# EAGLE design timerV2 (EAGLE 6.5.0)
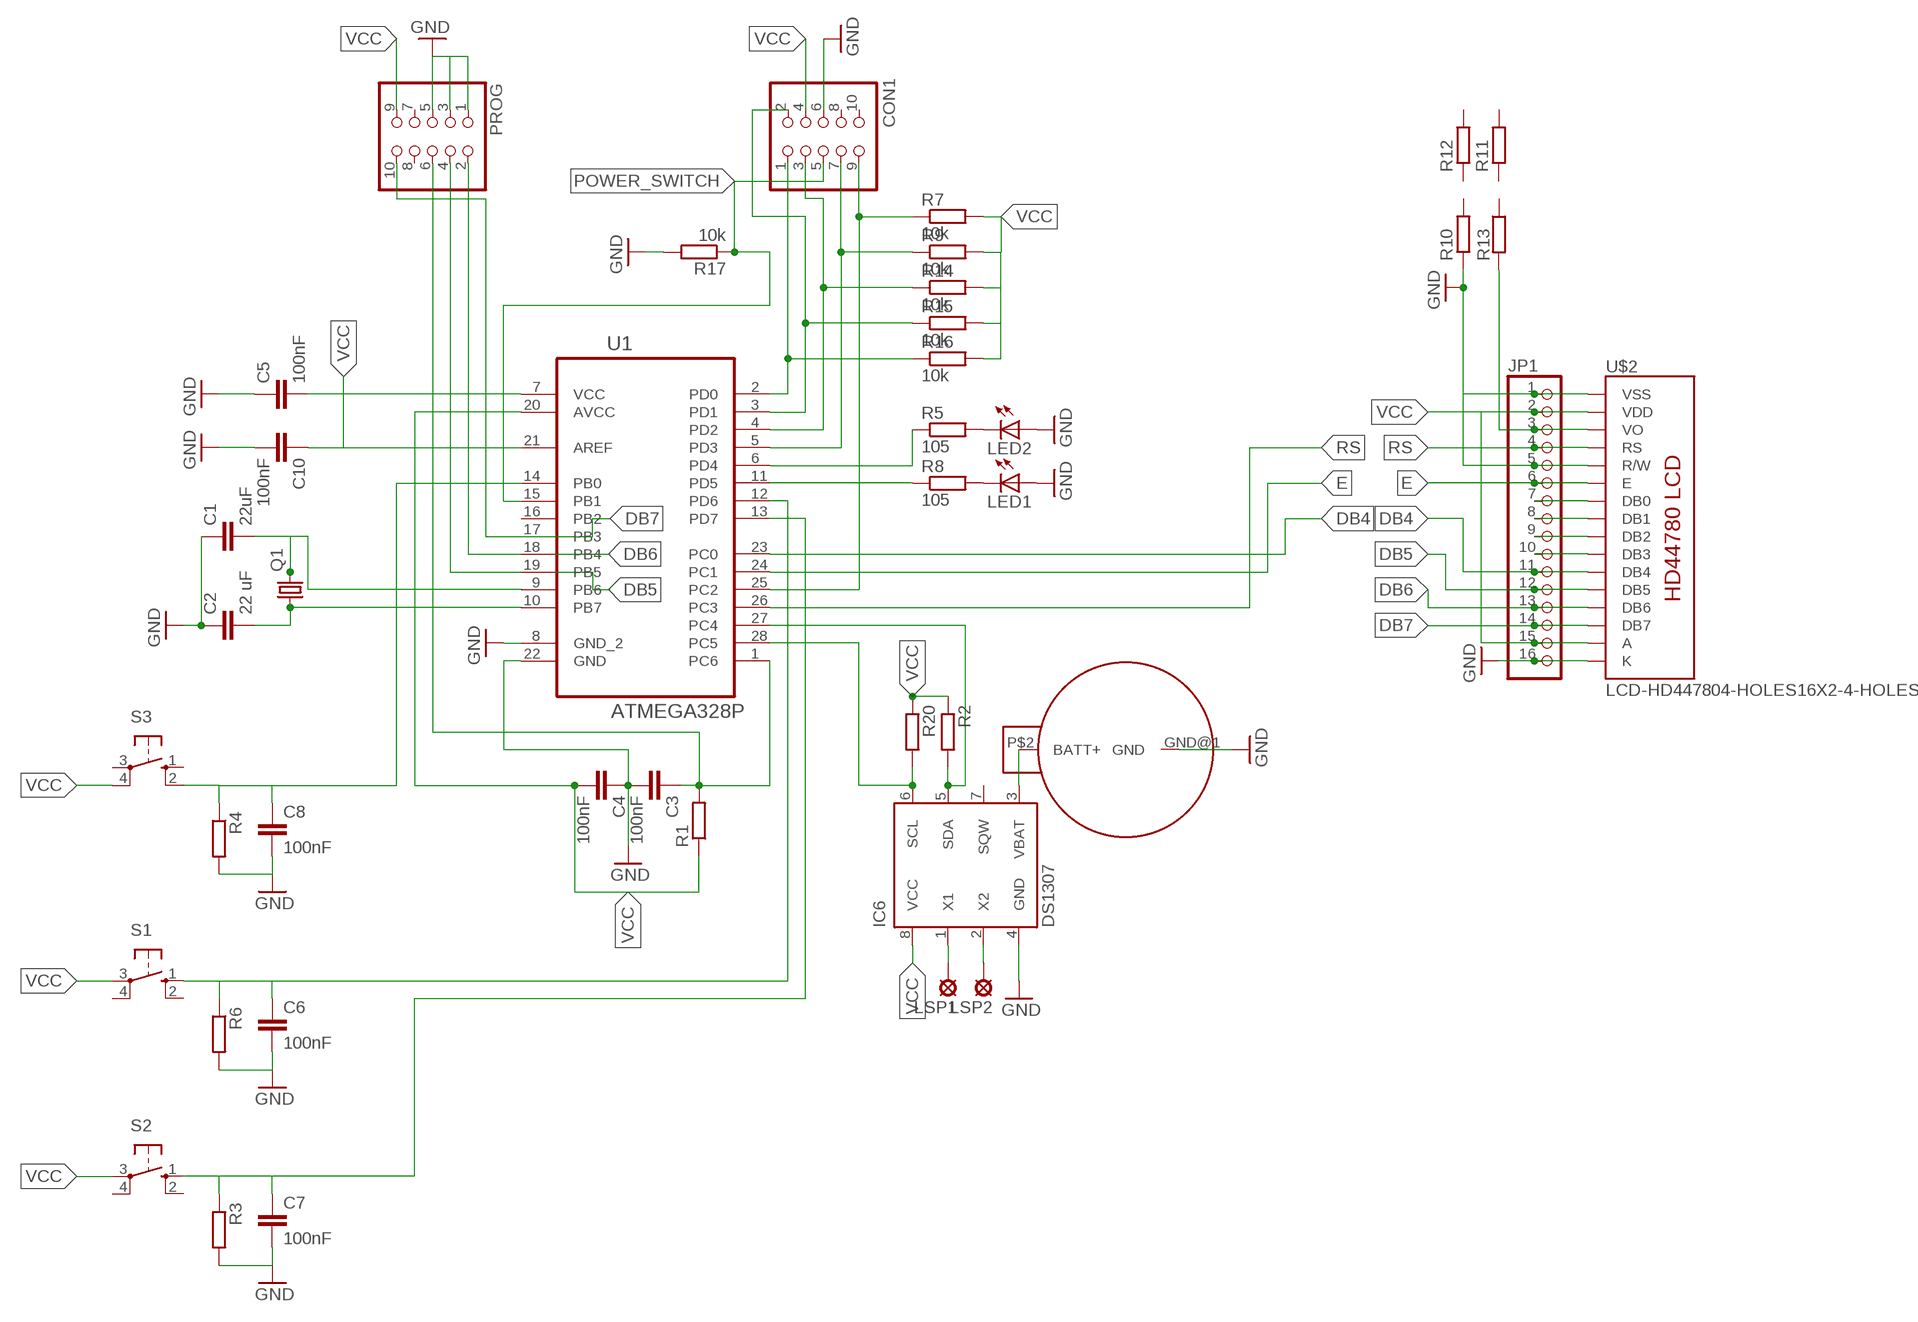
[diagram p0: schematic, sheet 1]

## Parts
C1  22uF  C-EU025-025X050  [C025-025X050]
C2  22 uF  C-EU025-025X050  [C025-025X050]
C3  100nF  CC0603  [C0603]
C4  100nF  CC0603  [C0603]
C5  100nF  CC0603  [C0603]
C6  100nF  CC0603  [C0603]
C7  100nF  CC0603  [C0603]
C8  100nF  CC0603  [C0603]
C10  100nF  CC0603  [C0603]
CON1  PINHD-2X5  [2X05]
IC6  DS1307  [DIL08]
JP1  PINHD-1X16  [1X16]
LED1  LED5MM  [LED5MM]
LED2  LED5MM  [LED5MM]
LSP1  LSP10  [LSP10]
LSP2  LSP10  [LSP10]
PROG  PINHD-2X5  [2X05]
Q1  CRYSTALHC49U-V  [HC49U-V]
R1  RR0603  [R0603]
R2  RR0603  [R0603]
R3  RR0603  [R0603]
R4  RR0603  [R0603]
R5  105  RR0603  [R0603]
R6  RR0603  [R0603]
R7  10k  RR0603  [R0603]
R8  105  RR0603  [R0603]
R9  10k  RR0603  [R0603]
R10  RR0603  [R0603]
R11  RR0603  [R0603]
R12  RR0603  [R0603]
R13  RR0603  [R0603]
R14  10k  RR0603  [R0603]
R15  10k  RR0603  [R0603]
R16  10k  RR0603  [R0603]
R17  10k  RR0603  [R0603]
R20  RR0603  [R0603]
S1  10-XX  [B3F-10XX]
S2  10-XX  [B3F-10XX]
S3  10-XX  [B3F-10XX]
U1  ATMEGA328P  ATMEGA328P-PU  [DIP254P762X457-28]
U$1  CR2032  [CR2023]
U$2  LCD-HD447804-HOLES16X2-4-HOLES  [LCD-16X2-4HOLES]

## Nets
DB4: JP1.11 U1.23(PC0) U$2.11(DB4)
DB5: JP1.12 PROG.4 U1.19(PB5) U$2.12(DB5)
DB6: JP1.13 PROG.2 U1.18(PB4) U$2.13(DB6)
DB7: JP1.14 PROG.10 U1.17(PB3) U$2.14(DB7)
E: JP1.6 U1.24(PC1) U$2.6(E)
GND: C1.1 C2.1 C3.2 C4.1 C5.1 C6.2 C7.2 C8.2 C10.2 CON1.6 IC6.4(GND) JP1.1 JP1.5 JP1.16 LED1.A LED2.A PROG.1 PROG.3 PROG.5 R3.2 R4.2 R6.2 R10.1 R17.2 U1.8(GND_2) U1.22(GND) U$1.GND@1(GND) U$2.1(VSS) U$2.5(R/W) U$2.16(K)
N$1: LED2.K(C) R5.2
N$2: JP1.3 R13.2 U$2.3(VO)
N$4: LED1.K(C) R8.2
N$5: C3.1 PROG.6 R1.2 U1.1(PC6)
N$8: C7.1 R3.1 S2.1(S) U1.13(PD7)
N$9: CON1.2 R15.1 U1.3(PD1)
N$10: JP1.7 U$2.7(DB0)
N$11: C8.1 R4.1 S3.2(S1) U1.14(PB0)
N$12: CON1.7 R9.1 U1.5(PD3)
N$13: R8.1 U1.11(PD5)
N$14: R5.1 U1.6(PD4)
N$15: CON1.1 R16.1 U1.2(PD0)
N$16: JP1.8 U$2.8(DB1)
N$17: CON1.3 R14.1 U1.4(PD2)
N$18: JP1.9 U$2.9(DB2)
N$19: JP1.10 U$2.10(DB3)
N$20: C6.1 R6.1 S1.1(S) U1.12(PD6)
N$33: IC6.2(X2) LSP2.MP
N$37: IC6.1(X1) LSP1.MP
N$38: IC6.3(VBAT) U$1.P$2(BATT+)
N$39: IC6.6(SCL) R20.2 U1.28(PC5)
N$40: IC6.5(SDA) R2.2 U1.27(PC4)
N$44: C1.2 Q1.2 U1.9(PB6)
N$46: C2.2 Q1.1 U1.10(PB7)
POWER_SWITCH: CON1.5 R17.1 U1.15(PB1)
RS: JP1.4 U1.26(PC3) U$2.4(RS)
RW: CON1.9 R7.1 U1.25(PC2)
VCC: C4.2 C5.2 C10.1 CON1.4 IC6.8(VCC) JP1.2 JP1.15 PROG.9 R1.1 R2.1 R7.2 R9.2 R14.2 R15.2 R16.2 R20.1 S1.3(P) S2.3(P) S3.4(P1) U1.7(VCC) U1.20(AVCC) U1.21(AREF) U$2.2(VDD) U$2.15(A)
Unconnected: CON1.8 CON1.10 IC6.7(SQW) PROG.7 PROG.8 R10.2 R11.1 R11.2 R12.1 R12.2 R13.1 S1.2(S1) S1.4(P1) S2.2(S1) S2.4(P1) S3.1(S) S3.3(P) U1.16(PB2)

## Library data of the parts
C1 C2 = resistor:C-EU: CAPACITOR, European symbol
C3-C8 C10 = eagle-ltspice:C: CAPACITOR, European symbol; SPICEMODEL: NONE; SPICEPREFIX: C
CON1 PROG = pinhead:PINHD-2X5: PIN HEADER
IC6 = ds1307_pcf8583:DS1307: I2C-Bus CLOCK/CALENDAR
JP1 = pinhead:PINHD-1X16: PIN HEADER
LED1 LED2 = led:LED: LED OSRAM: - CHIPLED LG R971, LG N971, LY N971, LG Q971, LY Q971, LO R971, LY R971 LH N974, LH R974 LS Q976, LO Q976, LY Q976 LO Q996 - Hyper CHIPLED LW Q18S LB Q993, LB Q99A, LB R99A - SideLED LS A670, LO A670, LY A670, LG A670, LP A670 LB A673, LV A673, LT A673, LW A673 LH A674 LY A675 LS A676, LA A676, LO A676, LY A676, LW A676 LS A679, LY A679, LG A679 - Hyper Micro SIDELED® LS Y876, LA Y876, LO Y876, LY Y876 LT Y87S - SmartLED LW L88C, LW L88S LB L89C, LB L89S, LG L890 LS L89K, LO L89K, LY L89K LS L896, LA L896, LO L896, LY L896 - TOPLED LS T670, LO T670, LY T670, LG T670, LP T670 LSG T670, LSP T670, LSY T670, LOP T670, LYG T670 LG T671, LOG T671, LSG T671 LB T673, LV T673, LT T673, LW T673 LH T674 LS T676, LA T676, LO T676, LY T676, LB T676, LH T676, LSB T676, LW T676 LB T67C, LV T67C, LT T67C, LS T67K, LO T67K, LY T67K, LW E67C LS E67B, LA E67B, LO E67B, LY E67B, LB E67C, LV E67C, LT E67C LW T67C LS T679, LY T679, LG T679 LS T770, LO T770, LY T770, LG T770, LP T770 LB T773, LV T773, LT T773, LW T773 LH T774 LS E675, LA E675, LY E675, LS T675 LS T776, LA T776, LO T776, LY T776, LB T776 LHGB T686 LT T68C, LB T68C - Hyper Mini TOPLED® LB M676 - Mini TOPLED Santana® LG M470 LS M47K, LO M47K, LY M47K Source: http://www.osram.convergy.de LUXEON: - LUMILED® LXK2-PW12-R00, LXK2-PW12-S00, LXK2-PW14-U00, LXK2-PW14-V00 LXK2-PM12-R00, LXK2-PM12-S00, LXK2-PM14-U00 LXK2-PE12-Q00, LXK2-PE12-R00, LXK2-PE12-S00, LXK2-PE14-T00, LXK2-PE14-U00 LXK2-PB12-K00, LXK2-PB12-L00, LXK2-PB12-M00, LXK2-PB14-N00, LXK2-PB14-P00, LXK2-PB14-Q00 LXK2-PR12-L00, LXK2-PR12-M00, LXK2-PR14-Q00, LXK2-PR14-R00 LXK2-PD12-Q00, LXK2-PD12-R00, LXK2-PD12-S00 LXK2-PH12-R00, LXK2-PH12-S00 LXK2-PL12-P00, LXK2-PL12-Q00, LXK2-PL12-R00 Source: www.luxeon.com KINGBRIGHT: KA-3528ASYC Source: www.kingbright.com
LSP1 LSP2 = solpad:LSP10: SOLDER PAD drill 1.0 mm, distributor Buerklin, 12H555
Q1 = crystal:CRYSTAL: CRYSTAL; OC_FARNELL: 1666969; OC_NEWARK: unknown
R1-R17 R20 = eagle-ltspice:R: RESISTOR, European symbol; SPICEMODEL: NONE; SPICEPREFIX: R
S1-S3 = switch-omron:10-XX: OMRON SWITCH; MPN: B3F-1000; OC_FARNELL: 176432; OC_NEWARK: 36M3542
U1 = Atmel_By_element14_Batch_1:ATMEGA328P-PU: 8-bit Microcontroller with In-System Programmable Flash; MPN: ATMEGA328P-PU; OC_FARNELL: 1715487; OC_NEWARK: 15R0268; PACKAGE: PDIP-28; SUPPLIER: Atmel
U$1 = 2032:CR2032
U$2 = HD44780LCD:LCD-HD44780

## Net classes
0 default: width 0.381 mm, drill 0.508 mm, clearance 0.254 mm

## Board
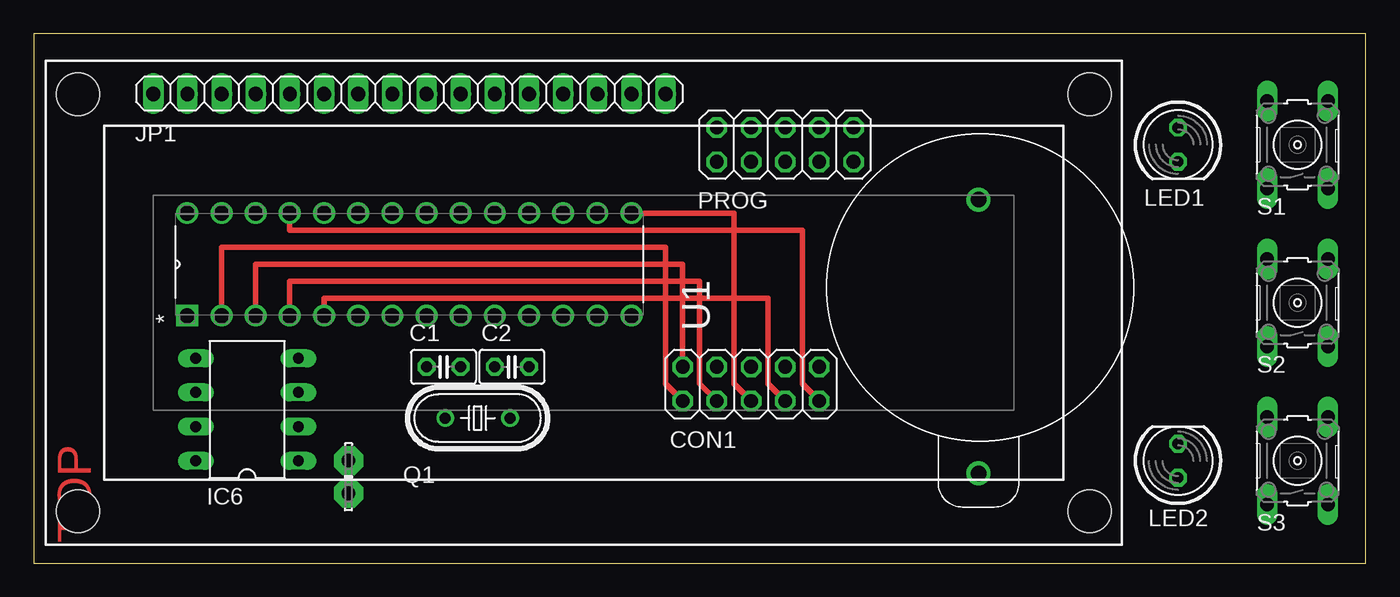
[diagram p1: board, top side]
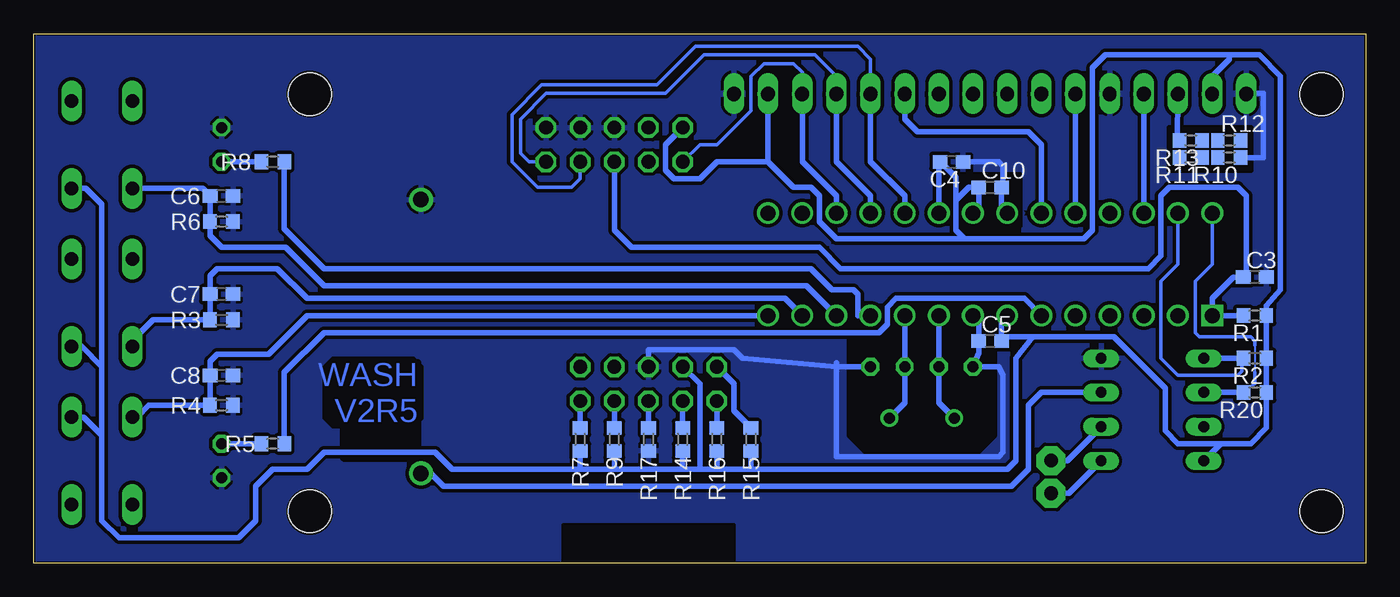
[diagram p2: board, bottom side, seen from below]

Size 99.06 x 39.37 mm. Coordinates in mm from the lower left corner, seen from the top.
Outline: 99.06,0 99.06,39.37 0,39.37 0,0 99.06,0
Copper layers (1*16): Top 0.035mm / dielectric 1.5mm / Bottom 0.035mm
Design rules "mohome *": minimum track width 5mil, minimum drill 12mil, track to track 5mil, track to pad 5mil, pad to pad 5mil, via to via 5mil, smd to smd 5mil, copper to edge 5mil, drill to drill 8mil, minimum pad ring 10mil, minimum via ring 6mil, stop-mask expansion 3mil, vias tented up to drill 0mil, thermal gap 8mil
bRestrict: area 27.6,8.3 to 38.4,18.7; area 47,0 to 59.7,2.9; area 8.6,29.2 to 14.6,32.4; area 25.7,25.1 to 30.5,28.9; area 70.2,10.2 to 77.5,15.2

### Footprints (pad centres in the part's own frame; a part is rotated, then mirrored left to right if it is on the bottom)
C025-025X050 = drill 0.813 octagon: 1 -1.27,0; 2 1.27,0
C0603 = smd 1.1 x 1: 1 -0.85,0; 2 0.85,0
2X05 = drill 1.016 octagon: 1 -5.08,-1.27; 2 -5.08,1.27; 3 -2.54,-1.27; 4 -2.54,1.27; 5 0,-1.27; 6 0,1.27; 7 2.54,-1.27; 8 2.54,1.27; 9 5.08,-1.27; 10 5.08,1.27
DIL08 = drill 0.813 long: 1 -3.81,-3.81; 2 -1.27,-3.81; 3 1.27,-3.81; 4 3.81,-3.81; 5 3.81,3.81; 6 1.27,3.81; 7 -1.27,3.81; 8 -3.81,3.81
1X16 = drill 1.016 long: 1 -19.05,0; 2 -16.51,0; 3 -13.97,0; 4 -11.43,0; 5 -8.89,0; 6 -6.35,0; 7 -3.81,0; 8 -1.27,0; 9 1.27,0; 10 3.81,0; 11 6.35,0; 12 8.89,0; 13 11.43,0; 14 13.97,0; 15 16.51,0; 16 19.05,0
LED5MM = drill 0.813 octagon: A -1.27,0; K 1.27,0
LSP10 = drill 1.016 pad 2.159 octagon: MP 0,0
HC49U-V = drill 0.813: 1 -2.413,0; 2 2.413,0
R0603 = smd 1 x 1.1: 1 -0.85,0; 2 0.85,0
B3F-10XX = drill 1.016 long: 1 -3.251,2.261; 2 3.251,2.261; 3 -3.251,-2.261; 4 3.251,-2.261
DIP254P762X457-28 = drill 1.118 square: 1 -7.62,33.02 | drill 1.118: 2 -7.62,30.48; 3 -7.62,27.94; 4 -7.62,25.4; 5 -7.62,22.86; 6 -7.62,20.32; 7 -7.62,17.78; 8 -7.62,15.24; 9 -7.62,12.7; 10 -7.62,10.16; 11 -7.62,7.62; 12 -7.62,5.08; 13 -7.62,2.54; 14 -7.62,0; 15 0,0; 16 0,2.54; 17 0,5.08; 18 0,7.62; 19 0,10.16; 20 0,12.7; 21 0,15.24; 22 0,17.78; 23 0,20.32; 24 0,22.86; 25 0,25.4; 26 0,27.94; 27 0,30.48; 28 0,33.02
CR2023 = drill 1.143 pad 1.778: GND@1 0,5.35; P$2 0,-15
LCD-16X2-4HOLES = drill 1.016 square: 1 -32,15.5 | drill 1.016: 2 -29.46,15.5; 3 -26.92,15.5; 4 -24.38,15.5; 5 -21.84,15.5; 6 -19.3,15.5; 7 -16.76,15.5; 8 -14.22,15.5; 9 -11.68,15.5; 10 -9.14,15.5; 11 -6.6,15.5; 12 -4.06,15.5; 13 -1.52,15.5; 14 1.02,15.5; 15 3.56,15.5; 16 6.1,15.5 | hole 3.2: -37.6,15.5; -37.6,-15.5; 37.6,-15.5; 37.6,15.5

### Placement (x,y rotation side)
C1  30.48,14.61 0 top
C2  35.56,14.61 180 top
C3  8.26,21.27 0 bottom
C4  30.8,29.85 180 bottom
C5  27.94,16.51 0 bottom
C6  85.09,27.3 0 bottom
C7  85.09,20 0 bottom
C8  85.09,13.97 0 bottom
C10  27.94,27.94 0 bottom
CON1  53.34,13.34 0 top
IC6  15.88,11.43 90 top
JP1  27.94,34.93 0 top
LED1  85.09,31.11 270 top
LED2  85.09,7.62 90 top
LSP1  23.41,5.21 270 top
LSP2  23.41,7.64 270 top
PROG  55.88,31.11 180 top
Q1  33.02,10.8 180 top
R1  8.26,18.41 180 bottom
R2  8.26,15.24 180 bottom
R3  85.09,18.1 0 bottom
R4  85.09,11.75 0 bottom
R5  81.28,8.89 180 bottom
R6  85.09,25.4 0 bottom
R7  58.42,9.21 270 bottom
R8  81.28,29.85 180 bottom
R9  55.88,9.21 270 bottom
R10  10.16,30.16 180 bottom
R11  13.02,30.16 180 bottom
R12  10.16,31.43 0 bottom
R13  13.02,31.43 180 bottom
R14  50.8,9.21 270 bottom
R15  45.72,9.21 270 bottom
R16  48.26,9.21 270 bottom
R17  53.34,9.21 270 bottom
R20  8.26,12.7 180 bottom
S1  93.98,31.11 90 top
S2  93.98,19.37 90 top
S3  93.98,7.62 90 top
U1  44.45,26.04 90 top
U$1  70.26,21.68 0 top
U$2  40.9,19.37 0 top

### Tracks (layer width: path | path; a pad name or v marks a point on that pad's centre or on a via)
DB4
  Bottom 0.406: JP1.11 U$2.11 34.29,34.8 34.29,33.02 33.34,32.07 25.08,32.07 24.13,31.11 U1.23
DB5
  Bottom 0.254: JP1.12 36.83,37.47 37.78,38.42 49.85,38.42 52.7,35.56 61.28,35.56 63.5,33.34 63.5,29.85 61.59,27.94 59.05,27.94 58.42,28.57 PROG.4
  Bottom 0.406: U1.19 34.29,27.3 36.83,29.85 JP1.12 36.89,34.87 U$2.12
DB6
  Bottom 0.254: PROG.2 62.23,29.85 62.87,30.48 62.87,33.02 60.96,34.93 52.07,34.93 49.21,37.78 40.96,37.78 39.37,36.2 JP1.13
  Bottom 0.406: U1.18 36.83,27.3 39.37,29.85 JP1.13 U$2.13
DB7
  Bottom 0.254: JP1.14 41.91,36.51 42.54,37.15 44.77,37.15 45.72,36.2 45.72,33.66 48.26,31.11 49.53,31.11 PROG.10
  Bottom 0.406: U$2.14 JP1.14 41.91,29.85 39.37,27.3 U1.17
E
  Bottom 0.406: U1.24 JP1.6 21.65,34.87 U$2.6
GND
  Bottom 0.406: R10.1 7.62,30.16 7.62,34.93 JP1.1 | U1.8 28.79,18 C5.1 28.79,15.66 C1.1 27.3,14.61 26.99,13.97 26.99,8.25 27.3,7.94 39.37,7.94 39.37,14.61 | C2.1 39.37,14.61 | 39.37,14.61 46.35,15.24 46.99,15.88 53.34,15.88 CON1.6 | 39.37,14.92 39.37,14.61 | U1.22 27.09,26.45 C10.2 26.99,28.04 26.99,29.53 27.3,29.85 C4.1
  pour Bottom: -3.81,45.09 100.06,44.66 99.63,-2.71 -3.81,-1.82
N$1
  Bottom 0.406: R5.2 LED2.K
N$2
  Bottom 0.406: JP1.3 14.03,34.87 U$2.3 14.04,31.43 R13.2
N$4
  Bottom 0.406: R8.2 LED1.K
N$5
  Bottom 0.406: PROG.6 55.88,24.77 54.61,23.5 40.64,23.5 39.05,21.91 16.19,21.91 15.24,22.86 15.24,27.3 14.61,27.94 9.53,27.94 8.89,27.3 8.89,21.49 C3.1 9.84,21.27 11.43,19.68 U1.1 R1.2
N$8
  Bottom 0.406: U1.13 43.18,19.68 78.74,19.68 80.96,21.91 85.41,21.91 85.94,21.38 C7.1 R3.1 90.17,18.1 91.72,16.55 S2.1
N$9
  Top 0.406: CON1.2 48.26,22.22 16.51,22.22 U1.3
  Bottom 0.406: CON1.2 46.99,13.34 46.99,11.33 R15.1
N$10
  Bottom 0.406: U$2.7 JP1.7
N$11
  Bottom 0.406: U1.14 78.74,18.41 81.6,15.56 85.41,15.56 85.94,15.02 C8.1 R4.1 90.49,11.75 91.36,10.87 S3.2
N$12
  Top 0.406: U1.5 21.59,19.68 54.61,19.68 54.61,13.34 CON1.7
  Bottom 0.406: CON1.7 R9.1
N$13
  Bottom 0.406: U1.11 37.78,18.41 37.78,20 38.1,20.32 39.69,20.32 41.27,21.91 77.47,21.91 80.43,24.87 R8.1
N$14
  Bottom 0.406: U1.6 25.4,19.68 34.92,19.68 35.56,19.05 35.56,17.78 36.2,17.14 77.47,17.14 80.43,14.18 R5.1
N$15
  Top 0.406: U1.2 13.97,23.5 46.99,23.5 46.99,13.34 CON1.1
  Bottom 0.406: CON1.1 R16.1
N$16
  Bottom 0.406: JP1.8 26.68,34.93 U$2.8
N$17
  Top 0.406: U1.4 19.05,20.95 49.53,20.95 49.53,13.34 CON1.3
  Bottom 0.406: CON1.3 R14.1
N$18
  Bottom 0.406: JP1.9 29.22,34.93 U$2.9
N$19
  Bottom 0.406: JP1.10 31.76,34.93 U$2.10
N$20
  Bottom 0.406: U1.12 41.59,20.64 77.47,20.64 80.33,23.5 85.09,23.5 85.94,24.34 R6.1 C6.1 86.5,27.86 S1.1
N$33
  Bottom 0.406: LSP2.MP 22.21,7.64 IC6.2
N$37
  Bottom 0.406: LSP1.MP 22.1,5.21 IC6.1
N$38
  Bottom 0.406: IC6.3 24.13,12.7 25.08,11.75 25.08,6.99 26.35,5.72 68.58,5.72 69.55,6.68 U$1.P$2
N$39
  Bottom 0.152: 8.26,16.19 8.26,14.18
  Bottom 0.254: IC6.6 12.1,12.67 | U1.28 11.43,22.22 12.7,20.95 12.7,17.14 12.38,16.83 8.57,16.83 8.26,16.51 8.26,16.19 | 8.26,14.18 8.26,13.34 R20.2
  Bottom 0.406: R20.2 IC6.6
N$40
  Bottom 0.254: U1.27 13.97,22.22 15.24,20.95 15.24,15.24 14.92,14.92 13.97,13.97 9.53,13.97 9.21,14.29 9.21,15.14 R2.2 8.89,15.66
  Bottom 0.406: R2.2 IC6.5
N$44
  Bottom 0.406: Q1.2 31.75,11.94 C1.2 U1.9
N$46
  Bottom 0.406: Q1.1 34.29,11.94 C2.2 U1.10
POWER_SWITCH
  Top 0.406: U1.15 52.07,26.04 52.07,13.34 CON1.5
  Bottom 0.406: CON1.5 R17.1
RS
  Bottom 0.406: U1.26 JP1.4 16.57,34.87 U$2.4
RW
  Top 0.406: U1.25 19.05,24.77 57.15,24.77 57.15,13.34 CON1.9
  Bottom 0.406: CON1.9 R7.1
VCC
  Bottom 0.406: 93.98,14.61 93.98,26.67 95.17,27.86 S1.3 | S2.3 95.49,16.12 93.98,14.61 | 93.98,9.52 93.98,14.61 | S3.4 95.33,10.87 93.98,9.52 | 93.98,9.52 93.98,3.17 92.71,1.91 83.82,1.91 82.55,3.17 82.55,5.72 81.28,6.99 78.74,6.99 77.47,8.25 69.22,8.25 67.95,6.99 58.42,6.99 | 10.16,37.78 19.37,37.78 20.32,36.83 20.32,24.77 20.96,24.13 29.84,24.13 | 10.16,37.78 7.94,37.78 6.35,36.2 6.35,20.32 7.41,19.15 R1.1 R2.1 R20.1 | 58.42,6.99 55.88,6.99 | 55.88,6.99 50.8,6.99 | 50.8,6.99 49.53,6.99 | 49.53,6.99 48.26,6.99 | 48.26,6.99 45.72,6.99 | 45.72,6.99 26.67,6.99 26.04,7.62 26.04,15.24 24.77,16.83 | 10.16,37.78 10.16,37.47 11.43,36.2 JP1.2 U$2.2 | 10.79,8.89 13.97,8.89 14.92,9.84 14.92,13.02 18.73,16.83 24.77,16.83 | R15.2 45.72,6.99 | R16.2 48.26,6.99 | R14.2 50.8,6.99 | R9.2 55.88,6.99 | R7.2 58.42,6.99 | 10.79,8.89 IC6.8 | CON1.4 49.53,13.34 49.53,6.99 | 26.99,16.79 C5.2 | 44.46,29.85 48.26,29.85 49.53,28.57 51.43,28.57 52.07,29.21 52.07,31.11 PROG.9 | 29.84,24.13 39.37,24.13 40.64,25.4 40.64,27.3 41.27,27.94 42.54,27.94 44.45,29.85 44.46,29.85 | 30.48,26.99 29.53,27.94 C10.1 28.79,26.45 U1.21 | 29.84,24.13 30.48,24.77 30.48,26.99 | U1.7 27.09,18 C5.2 | 30.48,26.99 30.48,28.68 C4.2 | R20.1 7.41,12.28 | 10.79,8.89 8.57,8.89 7.41,10.06 R20.1 | C4.2 31.75,29.74 U1.20 31.75,29.85 C4.2 | JP1.15 U$2.15 44.46,29.85 | 24.77,16.83 26.77,16.83 C5.2

### Text on the board
Top: TOP
Bottom: WASH / V2R5